# EAGLE design MAGNEBOT2 (EAGLE 7.6.0)
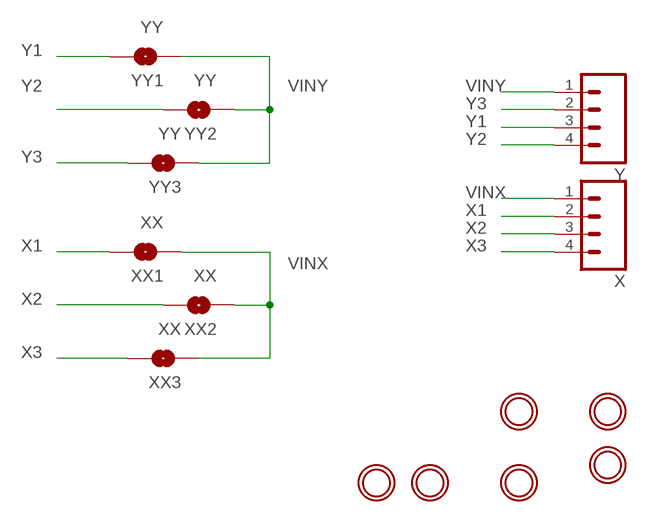
[diagram p0: schematic, sheet 1]

## Parts
U$1  MOUNTINGHOLE2.0  [MOUNTINGHOLE_2.0_PLATED]
U$2  MOUNTINGHOLE2.0  [MOUNTINGHOLE_2.0_PLATED]
U$3  MOUNTINGHOLE2.0  [MOUNTINGHOLE_2.0_PLATED]
U$4  MOUNTINGHOLE2.0  [MOUNTINGHOLE_2.0_PLATED]
U$5  MOUNTINGHOLE2.0  [MOUNTINGHOLE_2.0_PLATED]
U$10  MOUNTINGHOLE2.0  [MOUNTINGHOLE_2.0_PLATED]
X  M04PTH  [1X04]
XX1  XX  SOLDERJUMPERTRACE  [SJ_2S-TRACE]
XX2  XX  SOLDERJUMPERTRACE  [SJ_2S-TRACE]
XX3  XX  SOLDERJUMPERTRACE  [SJ_2S-TRACE]
Y  M04PTH  [1X04]
YY1  YY  SOLDERJUMPERTRACE  [SJ_2S-TRACE]
YY2  YY  SOLDERJUMPERTRACE  [SJ_2S-TRACE]
YY3  YY  SOLDERJUMPERTRACE  [SJ_2S-TRACE]

## Nets
VINX: X.1 XX1.1 XX2.1 XX3.1
VINY: Y.1 YY1.1 YY2.1 YY3.1
X1 [gnd]: X.2 XX1.2
X2: X.3 XX2.2
X3 [gnd]: X.4 XX3.2
Y1: Y.3 YY1.2
Y2: Y.4 YY2.2
Y3 [gnd]: Y.2 YY3.2

## Library data of the parts
U$1-U$5 U$10 = microbuilder:MOUNTINGHOLE: Mounting Hole For #2 screws (0.086"/2.18mm width, 0.094"/2.4mm hole) use 2.5mm; BOM: EXCLUDE
X Y = SparkFun:M04: Header 4 Standard 4-pin 0.1" header. Use with straight break away headers (SKU : PRT-00116), right angle break away headers (PRT-00553), swiss pins (PRT-00743), machine pins (PRT-00117), and female headers (PRT-00115). Molex polarized connector foot print use with SKU : PRT-08231 with associated crimp pins and housings.
XX1-XX3 YY1-YY3 = SparkFun:SOLDERJUMPER: Solder Jumper Standard SMD solder jumper. Used to automate production. Two varients : Normally Open and Normally Closed are the same, but have different paste layers. NC will have a large amount of paste and should jumper during reflow.

## Net classes
0 default: width 0.203 mm, drill 0.381 mm, clearance 0.203 mm
1 vcc: width 0.203 mm, drill 0.381 mm, clearance 0.203 mm
2 gnd: width 0.203 mm, drill 0.381 mm, clearance 0.203 mm

## Board
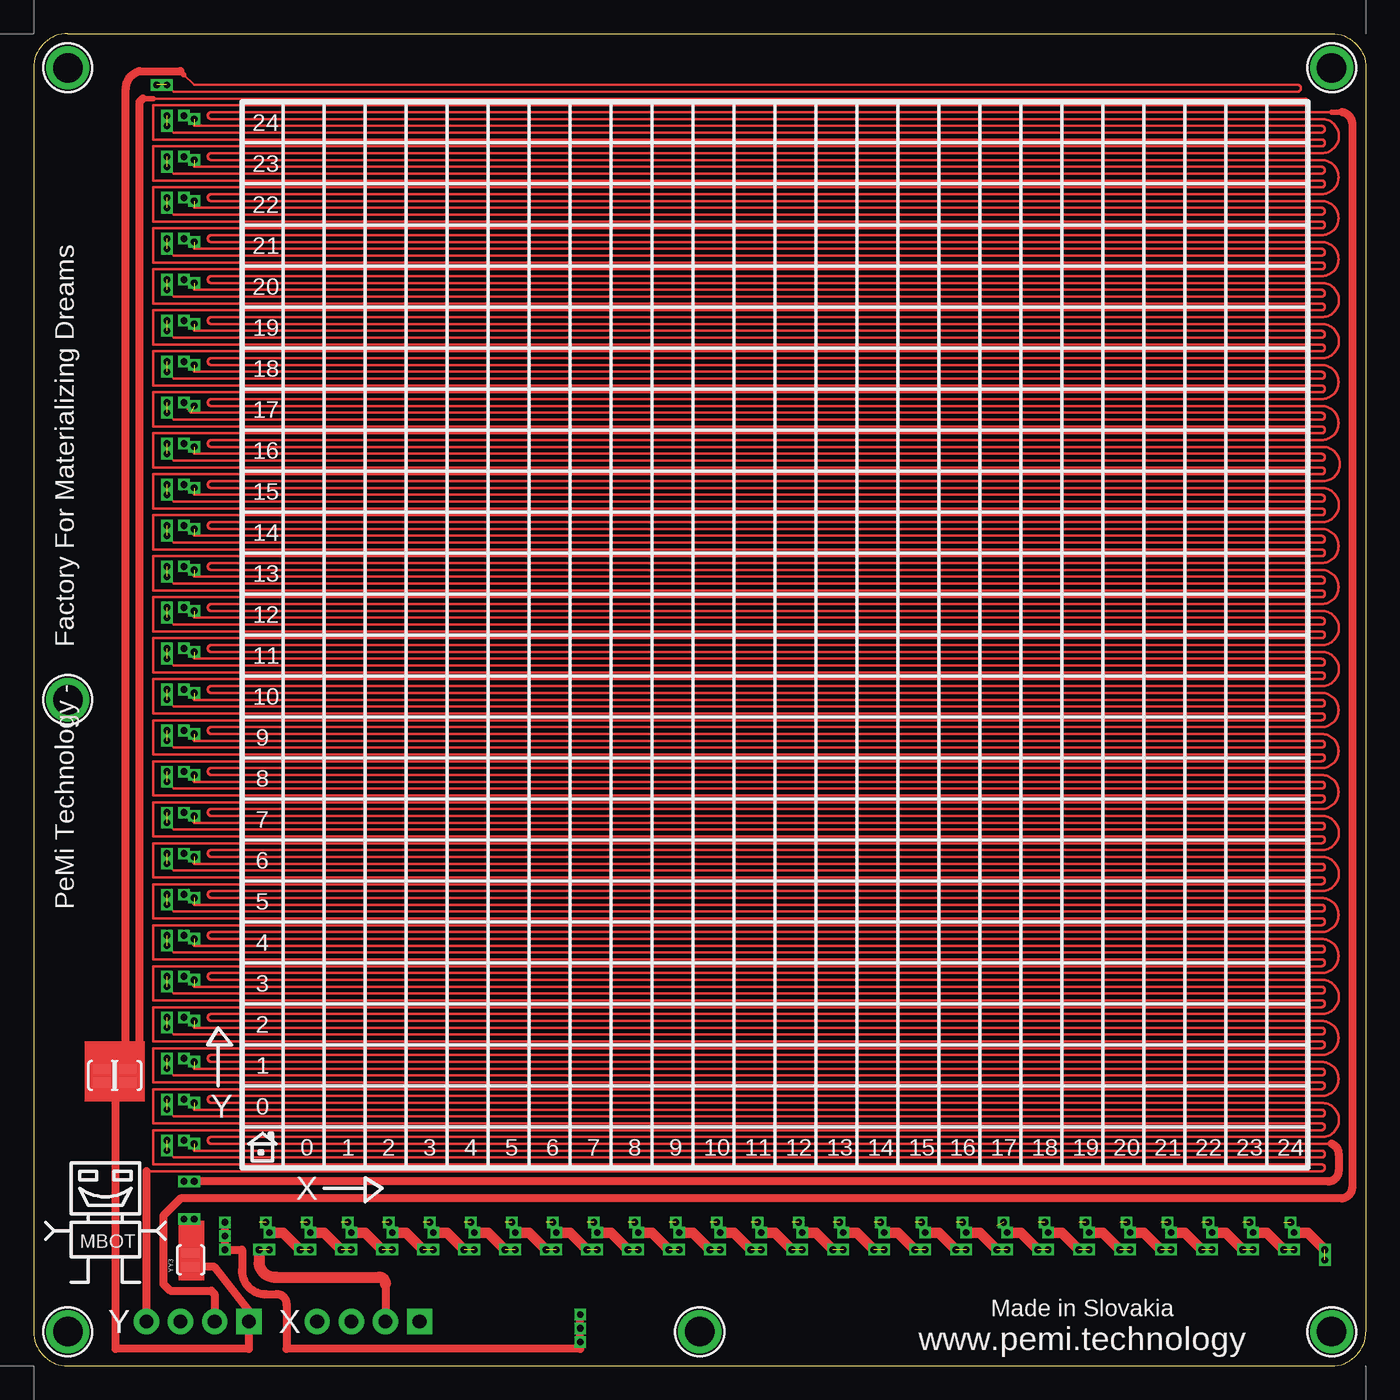
[diagram p1: board, top side]
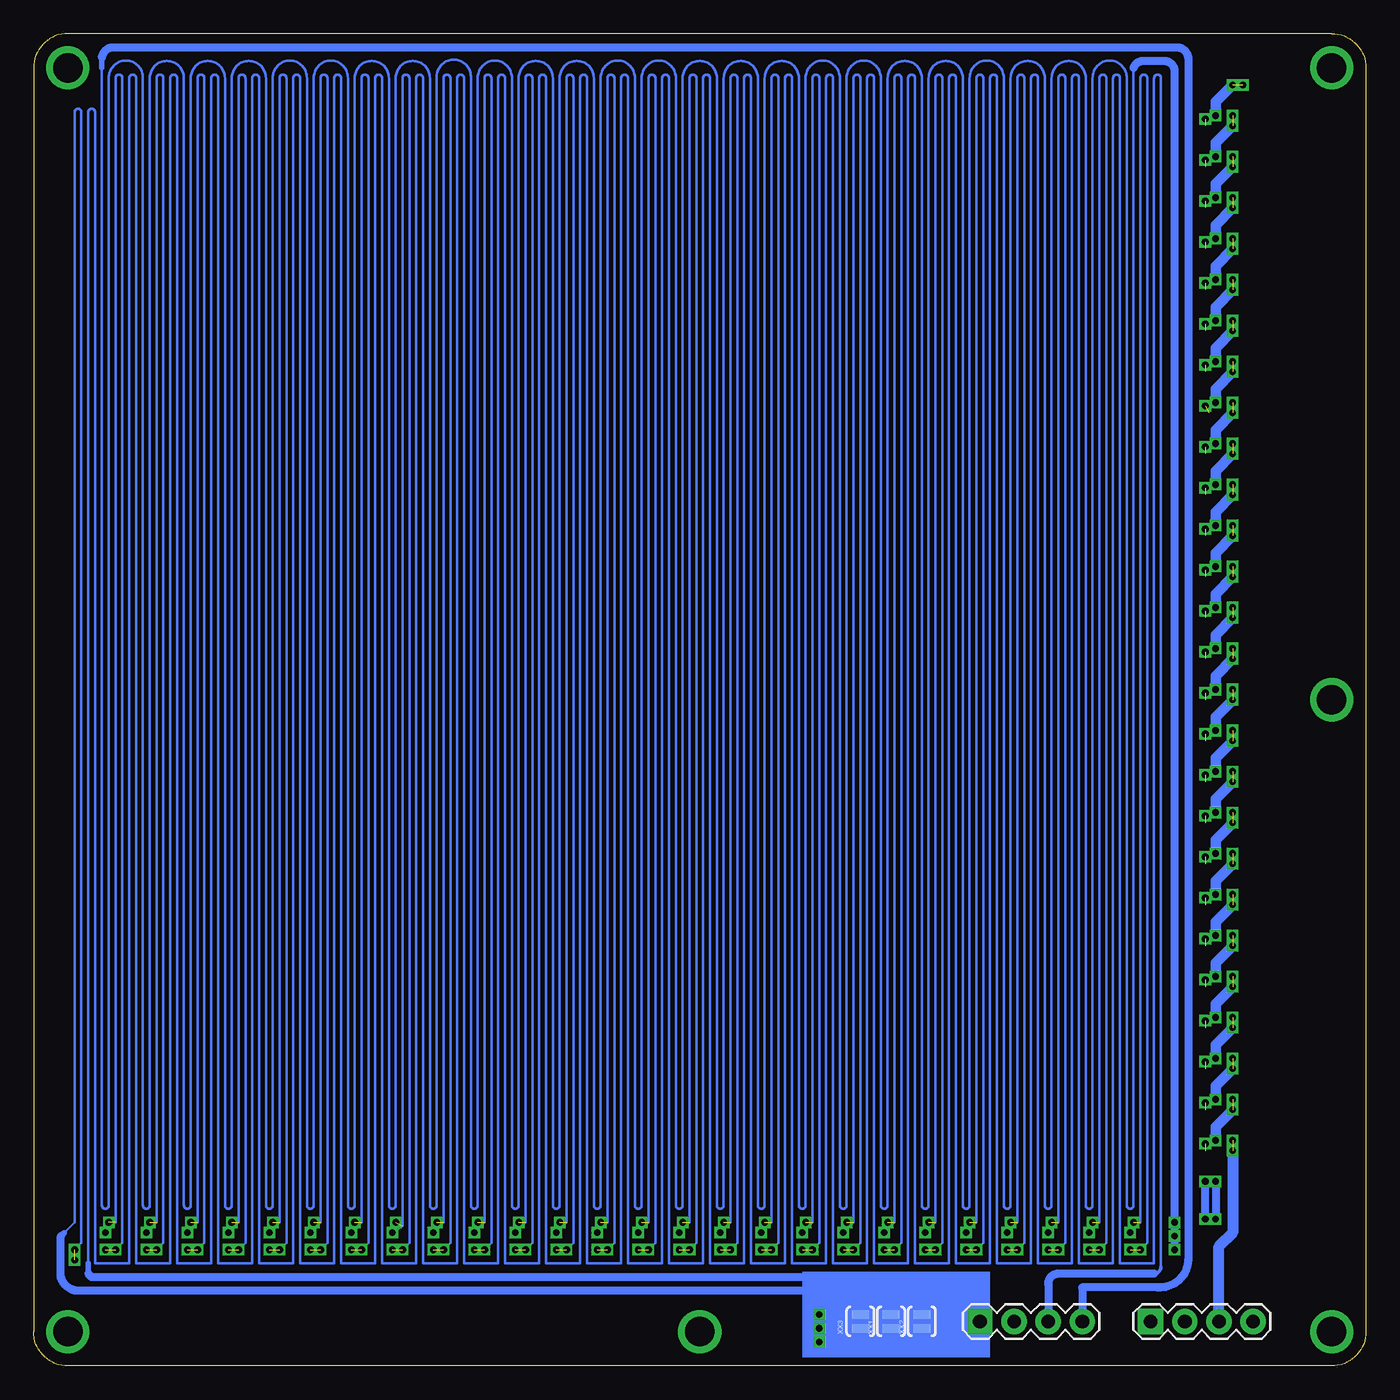
[diagram p2: board, bottom side, seen from below]

Size 99.06 x 99.06 mm. Coordinates in mm from the lower left corner, seen from the top.
Outline: 2.54,99.06 arc90 0,96.52 0,2.54 arc90 2.54,0 96.52,0 arc90 99.06,2.54 99.06,96.52 arc90 96.52,99.06 2.54,99.06
Copper layers (1*16): Top 0.0356mm / dielectric 1.5011mm / Bottom 0.0356mm
Design rules "LaenPCBOrder *": minimum track width 6mil, minimum drill 13mil, track to track 6mil, track to pad 6mil, pad to pad 6mil, via to via 6mil, smd to smd 6mil, copper to edge 15mil, drill to drill 6mil, minimum pad ring 7mil, minimum via ring 7mil, stop-mask expansion 4mil, vias tented up to drill 30mil, thermal gap 10mil

### Footprints (pad centres in the part's own frame; a part is rotated, then mirrored left to right if it is on the bottom)
MOUNTINGHOLE_2.0_PLATED = drill 2.2 pad 3: P$1 0,0
1X04 = drill 1.016 pad 1.88 square: 1 0,0 | drill 1.016 pad 1.88: 2 2.54,0; 3 5.08,0; 4 7.62,0
SJ_2S-TRACE = smd 0.635 x 1.27: 1 -0.508,0; 2 0.508,0

### Placement (x,y rotation side)
U$1  2.54,2.54 0 top
U$2  96.52,96.52 0 top
U$3  96.52,2.54 0 top
U$4  49.53,2.54 0 top
U$5  2.54,49.53 0 top
U$10  2.54,96.52 0 top
X  28.7,3.3 0 bottom
XX1  35.31,3.3 90 bottom
XX2  33.02,3.3 90 bottom
XX3  37.59,3.3 90 bottom
Y  16,3.3 0 bottom
YY1  5.08,21.59 90 top
YY2  6.99,21.59 90 top
YY3  11.68,7.87 90 top

### Tracks (layer width: path | path; a pad name or v marks a point on that pad's centre or on a via)
VINX
  Bottom 0.61: 28.7,3.24 X.1 29.15,2.85 XX2.1 XX1.1 XX3.1
VINY
  Top 0.61: 5.65,21.39 YY1.1 YY2.1 7.62,20.83 6.1,20.07 6.1,1.27 16,1.27 Y.1 16,4.12 13.46,7.37 YY3.1
X1  (via drill 0.5)  (53 unrouted)
  Top 0.61: 26.16,6.1 X.2
  Top 0.762: v17.53,9.91 18.54,9.91 v19.81,8.64 | v20.57,9.91 21.59,9.91 v22.86,8.64 | v26.67,9.91 27.69,9.91 v28.96,8.64 | v29.72,9.91 30.73,9.91 v32,8.64 | v35.81,9.91 36.83,9.91 v38.1,8.64 | v38.86,9.91 39.88,9.91 v41.15,8.64 | v44.96,9.91 45.97,9.91 v47.24,8.64 | v48.01,9.91 49.02,9.91 v50.29,8.64 | v54.1,9.91 55.12,9.91 v56.39,8.64 | v57.15,9.91 58.17,9.91 v59.44,8.64 | v63.25,9.91 64.26,9.91 v65.53,8.64 | v66.29,9.91 67.31,9.91 v68.58,8.64 | v23.62,9.91 24.64,9.91 v25.91,8.64 | v32.77,9.91 33.78,9.91 v35.05,8.64 | v41.91,9.91 42.93,9.91 v44.2,8.64 | v51.05,9.91 52.07,9.91 v53.34,8.64 | v60.2,9.91 61.21,9.91 v62.48,8.64 | v69.34,9.91 70.36,9.91 v71.63,8.64 | v75.44,9.91 76.45,9.91 v77.72,8.64 | v78.49,9.91 79.5,9.91 v80.77,8.64 | v84.58,9.91 85.6,9.91 v86.87,8.64 | v87.63,9.91 88.65,9.91 v89.92,8.64 | v93.73,9.91 94.74,9.91 v96.01,8.64 | v72.39,9.91 73.41,9.91 v74.68,8.64 | v81.53,9.91 82.55,9.91 v83.82,8.64 | v90.68,9.91 91.69,9.91 v92.96,8.64
  Top 0.813: v16.76,8.64 16.76,7.62 arc90 18.03,6.6 25.65,6.6 arc-90 26.16,6.1
  Bottom 0.203: v16.76,8.64 16.26,9.14 16.26,95.76 arc-180 16.76,95.76 16.76,10.67 v17.53,9.91 | v19.81,8.64 19.3,9.14 19.3,95.76 arc-180 19.81,95.76 19.81,10.67 v20.57,9.91 | v22.86,8.64 22.35,9.14 22.35,95.76 arc-180 22.86,95.76 22.86,10.67 v23.62,9.91 | v25.91,8.64 25.4,9.14 25.4,95.76 arc-180 25.91,95.76 25.91,10.67 v26.67,9.91 | v28.96,8.64 28.45,9.14 28.45,95.76 arc-180 28.96,95.76 28.96,10.67 v29.72,9.91 | v32,8.64 31.5,9.14 31.5,95.76 arc-180 32,95.76 32,10.67 v32.77,9.91 | v35.05,8.64 34.54,9.14 34.54,95.76 arc-180 35.05,95.76 35.05,10.67 v35.81,9.91 | v38.1,8.64 37.59,9.14 37.59,95.76 arc-180 38.1,95.76 38.1,10.67 v38.86,9.91 | v41.15,8.64 40.64,9.14 40.64,95.76 arc-180 41.15,95.76 41.15,10.67 v41.91,9.91 | v44.2,8.64 43.69,9.14 43.69,95.76 arc-180 44.2,95.76 44.2,10.67 v44.96,9.91 | v47.24,8.64 46.74,9.14 46.74,95.76 arc-180 47.24,95.76 47.24,10.67 v48.01,9.91 | v50.29,8.64 49.78,9.14 49.78,95.76 arc-180 50.29,95.76 50.29,10.67 v51.05,9.91 | v53.34,8.64 52.83,9.14 52.83,95.76 arc-180 53.34,95.76 53.34,10.67 v54.1,9.91 | v56.39,8.64 55.88,9.14 55.88,95.76 arc-180 56.39,95.76 56.39,10.67 v57.15,9.91 | v59.44,8.64 58.93,9.14 58.93,95.76 arc-180 59.44,95.76 59.44,10.67 v60.2,9.91 | v62.48,8.64 61.98,9.14 61.98,95.76 arc-180 62.48,95.76 62.48,10.67 v63.25,9.91 | v65.53,8.64 65.02,9.14 65.02,95.76 arc-180 65.53,95.76 65.53,10.67 v66.29,9.91 | v68.58,8.64 68.07,9.14 68.07,95.76 arc-180 68.58,95.76 68.58,10.67 v69.34,9.91 | v71.63,8.64 71.12,9.14 71.12,95.76 arc-180 71.63,95.76 71.63,10.41 v72.39,9.91 | v74.68,8.64 74.17,9.14 74.17,95.76 arc-180 74.68,95.76 74.68,10.67 v75.44,9.91
  Bottom 0.203: v77.72,8.64 77.22,9.14 77.22,95.76 arc-180 77.72,95.76 77.72,10.67 v78.49,9.91 | v80.77,8.64 80.26,9.14 80.26,95.76 arc-180 80.77,95.76 80.77,10.67 v81.53,9.91 | v83.82,8.64 83.31,9.14 83.31,95.76 arc-180 83.82,95.76 83.82,10.67 v84.58,9.91 | v86.87,8.64 86.36,9.14 86.36,95.76 arc-180 86.87,95.76 86.87,10.67 v87.63,9.91 | v89.92,8.64 89.41,9.14 89.41,95.76 arc-180 89.92,95.76 89.92,10.67 v90.68,9.91 | v92.96,8.64 92.46,9.14 92.46,95.76 arc-180 92.96,95.76 92.96,10.67 v93.73,9.91 | v96.01,8.64 95.5,9.14 95.5,93.22 arc-180 96.01,93.22 96.01,10.67 96.77,9.91
  Bottom 0.406: 97.03,9.65 96.77,9.91
  Bottom 0.61: 97.03,9.65 97.03,6.6 arc-74 95.76,5.59 35.31,5.59 XX1.2
  other vias: 17.27,10.67 17.53,8.64 20.32,10.67 20.57,8.64 23.37,10.67 23.62,8.64 26.67,8.64 26.42,10.67 29.46,10.67 29.72,8.64 32.51,10.67 32.77,8.64 35.81,8.64 35.56,10.67 38.61,10.67 38.86,8.64 41.66,10.67 41.91,8.64 44.7,10.67 44.96,8.64 47.75,10.67 48.01,8.64 50.8,10.67 51.05,8.64 53.85,10.67 54.1,8.64 56.9,10.67 57.15,8.64 59.94,10.67 60.2,8.64 62.99,10.67 63.25,8.64 66.04,10.67 66.29,8.64 69.09,10.67 69.34,8.64 72.14,10.67 72.39,8.64 75.44,8.64 75.18,10.67 78.23,10.67 78.49,8.64 81.28,10.67 81.53,8.64 84.33,10.67 84.58,8.64 87.38,10.67 87.63,8.64 90.42,10.67 90.68,8.64 93.47,10.67 93.73,8.64 96.01,7.87
X2
  Bottom 0.203: 15.24,7.37 15.24,95.76 arc-180 15.75,95.76 15.75,7.62 18.29,7.62 18.29,95.76 arc-180 18.8,95.76 18.8,7.62 21.34,7.62 21.34,95.76 arc-180 21.84,95.76 21.84,7.62 24.38,7.62 24.38,95.76 arc-180 24.89,95.76 24.89,7.62 27.43,7.62 27.43,95.76 arc-180 27.94,95.76 27.94,7.62 30.48,7.62 30.48,95.76 arc-180 30.99,95.76 30.99,7.62 33.53,7.62 33.53,95.76 arc-180 34.04,95.76 34.04,7.62 36.58,7.62 36.58,95.76 arc-180 37.08,95.76 37.08,7.62 39.62,7.62 39.62,95.76 arc-180 40.13,95.76 40.13,7.62 42.67,7.62 42.67,95.76 arc-180 43.18,95.76 43.18,7.62 45.72,7.62 45.72,95.76 arc-180 46.23,95.76 46.23,7.62 48.77,7.62 48.77,95.76 arc-180 49.28,95.76 49.28,7.62 51.82,7.62 51.82,95.76 arc-180 52.32,95.76 52.32,7.62 54.86,7.62 54.86,95.76 arc-180 55.37,95.76 55.37,7.62 57.91,7.62 57.91,95.76 arc-180 58.42,95.76 58.42,7.62 60.96,7.62 60.96,95.76 arc-180 61.47,95.76 61.47,7.62 64.01,7.62 64.01,95.76 arc-180 64.52,95.76 64.52,7.62 67.06,7.62 67.06,95.76 arc-180 67.56,95.76 67.56,7.62 70.1,7.62 70.1,95.76 arc-180 70.61,95.76 70.61,7.62 73.15,7.62 73.15,95.76 arc-180 73.66,95.76 73.66,7.62 76.2,7.62 76.2,95.76 arc-180 76.71,95.76 76.71,7.62 79.25,7.62 79.25,95.76 arc-180 79.76,95.76 79.76,7.62 82.3,7.62 82.3,95.76 arc-180 82.8,95.76 82.8,7.62 85.34,7.62 85.34,95.76 arc-180 85.85,95.76 85.85,7.62 88.39,7.62 88.39,95.76 arc-180 88.9,95.76 88.9,7.62 91.44,7.62 91.44,95.76 arc-180 91.95,95.76 91.95,7.62 94.49,7.62 94.49,93.22 arc-180 95,93.22 95,7.62
  Bottom 0.254: 15.24,7.37 arc90 15.75,6.86
  Bottom 0.406: 95,7.62 95,6.86
  Bottom 0.61: 95,6.86 94.74,6.6 33.08,6.6 XX2.2 | 15.75,6.86 22.86,6.86 arc-90 23.62,6.1 X.3
X3  (via drill 0.5)
  Top 0.61: v14.22,10.67 v14.22,9.65 v14.22,8.64 15.49,8.64 15.49,7.11 arc93 17.27,5.33 18.03,5.33 arc-99 18.8,4.57 18.8,1.27 40.64,1.27 v40.64,1.78 v40.64,2.79 v40.64,3.81
  Bottom 0.203: 17.27,96.52 17.27,11.94 arc180 17.78,11.94 17.78,95.76 arc-182 20.32,95.76 20.32,11.94 arc180 20.83,11.94 20.83,95.76 arc-180 23.37,95.76 23.37,11.94 arc180 23.88,11.94 23.88,95.76 arc-180 26.42,95.76 26.42,11.94 arc180 26.92,11.94 26.92,95.76 arc-182 29.46,95.76 29.46,11.94 arc180 29.97,11.94 29.97,95.76 arc-180 32.51,95.76 32.51,11.94 arc180 33.02,11.94 33.02,95.76 arc-180 35.56,95.76 35.56,11.94 arc180 36.07,11.94 36.07,95.76 arc-182 38.61,95.76 38.61,11.94 arc180 39.12,11.94 39.12,95.76 arc-182 41.66,95.76 41.66,11.94 arc180 42.16,11.94 42.16,95.76 arc-180 44.7,95.76 44.7,11.94 arc180 45.21,11.94 45.21,95.76 arc-180 47.75,95.76 47.75,11.94 arc180 48.26,11.94 48.26,95.76 arc-180 50.8,95.76 50.8,11.94 arc180 51.31,11.94 51.31,95.76 arc-182 53.85,95.76 53.85,11.94 arc180 54.36,11.94 54.36,95.76 arc-182 56.9,95.76 56.9,11.94 arc180 57.4,11.94 57.4,95.76 arc-180 59.94,95.76 59.94,11.94 arc180 60.45,11.94 60.45,95.76 arc-180 62.99,95.76 62.99,11.94 arc180 63.5,11.94 63.5,95.76 arc-182 66.04,95.76 66.04,11.94 arc180 66.55,11.94 66.55,95.76 arc-189 69.09,95.76 69.09,11.94 arc180 69.6,11.94 69.6,95.76 arc-180 72.14,95.76 72.14,11.94 arc180 72.64,11.94 72.64,95.76 arc-180 75.18,95.76 75.18,11.94 arc180 75.69,11.94 75.69,95.76 arc-182 78.23,95.76 78.23,11.94 arc180 78.74,11.94 78.74,95.76 arc-182 81.28,95.76 81.28,11.94 arc180 81.79,11.94 81.79,95.76 arc-180 84.33,95.76 84.33,11.94 arc180 84.84,11.94 84.84,95.76 arc-180 87.38,95.76 87.38,11.94 arc180 87.88,11.94 87.88,95.76 arc-180 90.42,95.76 90.42,11.94 arc180 90.93,11.94 90.93,95.76 arc-182 93.47,95.76 93.47,11.94 arc180 93.98,11.94 93.98,96.52
  Bottom 0.406: 93.98,96.52 93.98,97.28
  Bottom 0.61: 17.27,96.52 arc74 16.51,97.03 14.99,97.03 arc90 14.22,96.27 v14.22,10.67 v14.22,9.65 v14.22,8.64 | v40.64,1.78 v40.64,2.79 v40.64,3.81 XX3.2 | 93.98,97.28 arc74 93.22,98.04 13.97,98.04 arc74 13.21,97.28 13.21,7.87 arc93 15.49,5.84 21.08,5.84 X.4
Y1  (via drill 0.5)  (53 unrouted)
  Top 0.203: v9.91,16 10.41,15.49 95.76,15.49 arc180 95.76,16 11.94,16 v11.18,16.76 | v9.91,19.05 10.41,18.54 95.76,18.54 arc180 95.76,19.05 11.94,19.05 v11.18,19.81 | v9.91,22.1 10.41,21.59 95.76,21.59 arc180 95.76,22.1 11.94,22.1 v11.18,22.86 | v9.91,25.15 10.41,24.64 95.76,24.64 arc180 95.76,25.15 11.94,25.15 v11.18,25.91 | v9.91,28.19 10.41,27.69 95.76,27.69 arc180 95.76,28.19 11.94,28.19 v11.18,28.96 | v9.91,31.24 10.41,30.73 95.76,30.73 arc180 95.76,31.24 11.94,31.24 v11.18,32 | v9.91,34.29 10.41,33.78 95.76,33.78 arc180 95.76,34.29 11.94,34.29 v11.18,35.05 | v9.91,37.34 10.41,36.83 95.76,36.83 arc180 95.76,37.34 11.94,37.34 v11.18,38.1 | v9.91,40.39 10.41,39.88 95.76,39.88 arc180 95.76,40.39 11.94,40.39 v11.18,41.15 | v9.91,43.43 10.41,42.93 95.76,42.93 arc180 95.76,43.43 11.94,43.43 v11.18,44.2 | v9.91,46.48 10.41,45.97 95.76,45.97 arc180 95.76,46.48 11.94,46.48 v11.18,47.24 | v9.91,49.53 10.41,49.02 95.76,49.02 arc180 95.76,49.53 11.94,49.53 v11.18,50.29 | v9.91,52.58 10.41,52.07 95.76,52.07 arc180 95.76,52.58 11.94,52.58 v11.18,53.34 | v9.91,55.63 10.41,55.12 95.76,55.12 arc180 95.76,55.63 11.94,55.63 v11.18,56.39 | v9.91,58.67 10.41,58.17 95.76,58.17 arc180 95.76,58.67 11.94,58.67 v11.18,59.44 | v9.91,61.72 10.41,61.21 95.76,61.21 arc180 95.76,61.72 11.94,61.72 v11.18,62.48 | v9.91,64.77 10.41,64.26 95.76,64.26 arc180 95.76,64.77 11.94,64.77 v11.18,65.53 | v9.91,67.82 10.41,67.31 95.76,67.31 arc180 95.76,67.82 11.94,67.82 v11.18,68.58 | v9.91,70.87 10.41,70.36 95.76,70.36 arc180 95.76,70.87 11.68,70.87 v11.18,71.63 | v9.91,73.91 10.41,73.41 95.76,73.41 arc180 95.76,73.91 11.94,73.91 v11.18,74.68
  Top 0.203: v9.91,76.96 10.41,76.45 95.76,76.45 arc180 95.76,76.96 11.94,76.96 v11.18,77.72 | v9.91,80.01 10.41,79.5 95.76,79.5 arc180 95.76,80.01 11.94,80.01 v11.18,80.77 | v9.91,83.06 10.41,82.55 95.76,82.55 arc180 95.76,83.06 11.94,83.06 v11.18,83.82 | v9.91,86.11 10.41,85.6 95.76,85.6 arc180 95.76,86.11 11.94,86.11 v11.18,86.87 | v9.91,89.15 10.41,88.65 95.76,88.65 arc180 95.76,89.15 11.94,89.15 v11.18,89.92 | v9.91,92.2 10.41,91.69 95.76,91.69 arc180 95.76,92.2 11.94,92.2 v11.18,92.96 | v9.91,95.25 10.41,94.74 93.98,94.74 arc180 93.98,95.25 11.94,95.25 11.18,96.01
  Top 0.406: 10.92,96.27 11.18,96.01
  Top 0.61: 10.92,96.27 7.87,96.27 arc74 6.86,95 6.86,23.62 YY1.2
  Bottom 0.762: v11.18,16.76 11.18,17.78 v9.91,19.05 | v11.18,19.81 11.18,20.83 v9.91,22.1 | v11.18,25.91 11.18,26.92 v9.91,28.19 | v11.18,28.96 11.18,29.97 v9.91,31.24 | v11.18,35.05 11.18,36.07 v9.91,37.34 | v11.18,38.1 11.18,39.12 v9.91,40.39 | v11.18,44.2 11.18,45.21 v9.91,46.48 | v11.18,47.24 11.18,48.26 v9.91,49.53 | v11.18,53.34 11.18,54.36 v9.91,55.63 | v11.18,56.39 11.18,57.4 v9.91,58.67 | v11.18,62.48 11.18,63.5 v9.91,64.77 | v11.18,65.53 11.18,66.55 v9.91,67.82 | v11.18,22.86 11.18,23.88 v9.91,25.15 | v11.18,32 11.18,33.02 v9.91,34.29 | v11.18,41.15 11.18,42.16 v9.91,43.43 | v11.18,50.29 11.18,51.31 v9.91,52.58 | v11.18,59.44 11.18,60.45 v9.91,61.72 | v11.18,68.58 11.18,69.6 v9.91,70.87 | v11.18,74.68 11.18,75.69 v9.91,76.96 | v11.18,77.72 11.18,78.74 v9.91,80.01 | v11.18,83.82 11.18,84.84 v9.91,86.11 | v11.18,86.87 11.18,87.88 v9.91,89.15 | v11.18,92.96 11.18,93.98 v9.91,95.25 | v11.18,71.63 11.18,72.64 v9.91,73.91 | v11.18,80.77 11.18,81.79 v9.91,83.06 | v11.18,89.92 11.18,90.93 v9.91,92.2
  Bottom 0.813: v9.91,16 9.91,9.91 10.92,8.89 Y.3
  other vias: 9.14,95.25 9.91,92.96 11.94,92.71 9.91,89.92 11.94,89.66 9.91,86.87 11.94,86.61 9.91,83.82 11.94,83.57 9.91,80.77 11.94,80.52 9.91,77.72 11.94,77.47 9.91,74.68 11.94,74.42 9.91,71.63 11.94,71.37 9.91,68.58 11.94,68.33 9.91,65.53 11.94,65.28 9.91,62.48 11.94,62.23 9.91,59.44 11.94,59.18 9.91,56.39 11.94,56.13 9.91,53.34 11.94,53.09 9.91,50.29 11.94,50.04 9.91,47.24 11.94,46.99 9.91,44.2 11.94,43.94 9.91,41.15 11.94,40.89 9.91,38.1 11.94,37.85 9.91,35.05 11.94,34.8 9.91,32 11.94,31.75 9.91,28.96 11.94,28.7 9.91,25.91 11.94,25.65 9.91,22.86 11.94,22.61 9.91,19.81 11.94,19.56 9.91,16.76 11.94,16.51
Y2
  Top 0.203: 8.38,14.48 95.76,14.48 arc180 95.76,14.99 8.89,14.99 8.89,17.53 95.76,17.53 arc180 95.76,18.03 8.89,18.03 8.89,20.57 95.76,20.57 arc180 95.76,21.08 8.89,21.08 8.89,23.62 95.76,23.62 arc180 95.76,24.13 8.89,24.13 8.89,26.67 95.76,26.67 arc180 95.76,27.18 8.89,27.18 8.89,29.72 95.76,29.72 arc180 95.76,30.23 8.89,30.23 8.89,32.77 95.76,32.77 arc180 95.76,33.27 8.89,33.27 8.89,35.81 95.76,35.81 arc180 95.76,36.32 8.89,36.32 8.89,38.86 95.76,38.86 arc180 95.76,39.37 8.89,39.37 8.89,41.91 95.76,41.91 arc180 95.76,42.42 8.89,42.42 8.89,44.96 95.76,44.96 arc180 95.76,45.47 8.89,45.47 8.89,48.01 95.76,48.01 arc180 95.76,48.51 8.89,48.51 8.89,51.05 95.76,51.05 arc180 95.76,51.56 8.89,51.56 8.89,54.1 95.76,54.1 arc180 95.76,54.61 8.89,54.61 8.89,57.15 95.76,57.15 arc180 95.76,57.66 8.89,57.66 8.89,60.2 95.76,60.2 arc180 95.76,60.71 8.89,60.71 8.89,63.25 95.76,63.25 arc180 95.76,63.75 8.89,63.75 8.89,66.29 95.76,66.29 arc180 95.76,66.8 8.89,66.8 8.89,69.34 95.76,69.34 arc180 95.76,69.85 8.89,69.85 8.89,72.39 95.76,72.39 arc180 95.76,72.9 8.89,72.9 8.89,75.44 95.76,75.44 arc180 95.76,75.95 8.89,75.95 8.89,78.49 95.76,78.49 arc180 95.76,78.99 8.89,78.99 8.89,81.53 95.76,81.53 arc180 95.76,82.04 8.89,82.04 8.89,84.58 95.76,84.58 arc180 95.76,85.09 8.89,85.09 8.89,87.63 95.76,87.63 arc180 95.76,88.14 8.89,88.14 8.89,90.68 95.76,90.68 arc180 95.76,91.19 8.89,91.19 8.89,93.73 94.49,93.73 arc180 94.49,94.23 8.89,94.23
  Top 0.406: 8.89,94.23 8.13,94.23
  Top 0.61: 8.13,94.23 7.87,93.98 7.87,23.62 7.62,23.11 YY2.2 | 8.38,14.48 Y.4
Y3  (via drill 0.5)
  Top 0.203: 96.52,16.51 13.21,16.51 arc-180 13.21,17.02 95.76,17.02 arc182 95.76,19.56 13.21,19.56 arc-180 13.21,20.07 95.76,20.07 arc180 95.76,22.61 13.21,22.61 arc-180 13.21,23.11 95.76,23.11 arc180 95.76,25.65 13.21,25.65 arc-180 13.21,26.16 95.76,26.16 arc182 95.76,28.7 13.21,28.7 arc-180 13.21,29.21 95.76,29.21 arc180 95.76,31.75 13.21,31.75 arc-180 13.21,32.26 95.76,32.26 arc180 95.76,34.8 13.21,34.8 arc-180 13.21,35.31 95.76,35.31 arc182 95.76,37.85 13.21,37.85 arc-180 13.21,38.35 95.76,38.35 arc182 95.76,40.89 13.21,40.89 arc-180 13.21,41.4 95.76,41.4 arc180 95.76,43.94 13.21,43.94 arc-180 13.21,44.45 95.76,44.45 arc180 95.76,46.99 13.21,46.99 arc-180 13.21,47.5 95.76,47.5 arc180 95.76,50.04 13.21,50.04 arc-180 13.21,50.55 95.76,50.55 arc182 95.76,53.09 13.21,53.09 arc-180 13.21,53.59 95.76,53.59 arc182 95.76,56.13 13.21,56.13 arc-180 13.21,56.64 95.76,56.64 arc180 95.76,59.18 13.21,59.18 arc-180 13.21,59.69 95.76,59.69 arc180 95.76,62.23 13.21,62.23 arc-180 13.21,62.74 95.76,62.74 arc182 95.76,65.28 13.21,65.28 arc-180 13.21,65.79 95.76,65.79 arc189 95.76,68.33 13.21,68.33 arc-180 13.21,68.83 95.76,68.83 arc180 95.76,71.37 13.21,71.37 arc-180 13.21,71.88 95.76,71.88 arc180 95.76,74.42 13.21,74.42 arc-180 13.21,74.93 95.76,74.93 arc182 95.76,77.47 13.21,77.47 arc-180 13.21,77.98 95.76,77.98 arc182 95.76,80.52 13.21,80.52 arc-180 13.21,81.03 95.76,81.03 arc180 95.76,83.57 13.21,83.57 arc-180 13.21,84.07 95.76,84.07 arc180 95.76,86.61 13.21,86.61 arc-180 13.21,87.12 95.76,87.12 arc180 95.76,89.66 13.21,89.66 arc-180 13.21,90.17 95.76,90.17 arc182 95.76,92.71 13.21,92.71 arc-180 13.21,93.22 96.52,93.22
  Top 0.406: 96.52,93.22 97.28,93.22
  Top 0.61: 96.52,16.51 arc-74 97.03,15.75 97.03,14.48 arc-90 96.27,13.72 v11.94,13.72 | 97.28,93.22 arc-74 98.04,92.46 98.04,13.21 arc-74 97.28,12.45 10.92,12.45 9.65,11.18 9.65,6.1 10.16,5.59 13.21,5.59 13.46,5.33 Y.2 | YY3.2 11.68,10.41 v11.94,10.92
  Bottom 0.61: v11.94,10.92 v11.94,13.72 v11.18,13.72 v11.18,10.92 v11.94,10.92
(copper drawn outside any net)
  shapes: Bottom area x1, Top area x2

### Text on the board
tNames: 24 | 23 | 22 | 21 | 20 | 19 | 18 | 17 | 16 | 15 | 14 | PeMi Technology - Factory For Materializing Dreams | 13 | 12 | 11 | 10 | 9 | 8 | 7 | 6 | 5 | 4 | 3 | 2 | 1 | Y | 0 | 0 | 1 | 2 | 3 | 4 | 5 | 6 | 7 | 8 | 9 | 10 | 11 | 12 | 13 | 14 | 15 | 16 | 17 | 18 | 19 | 20 | 21 | 22 | 23 | 24 | X | MBOT | Made in Slovakia | Y | X | www.pemi.technology